# EasyEDA Pro project 学期项目.epro, schematic Schematic1

## Sheets
1 P2: Assembly Variant: Basic; Board Name: Board1; Create Date: 2026-03-26; Page Name: P2; Project Name: 学期项目_2026-03-26_14-34-54; Schematic Name: Schematic1; Update Date: 2026-03-26; BladeWidth: 10; Company: 嘉立创EDA; Page Size: A4; RegionStart: 1; ShowBorder: 1; TitleBlock: 1; TitleBlockPosition: 3; Version: V1.0; XRegionCount: 6; YRegionCount: 4
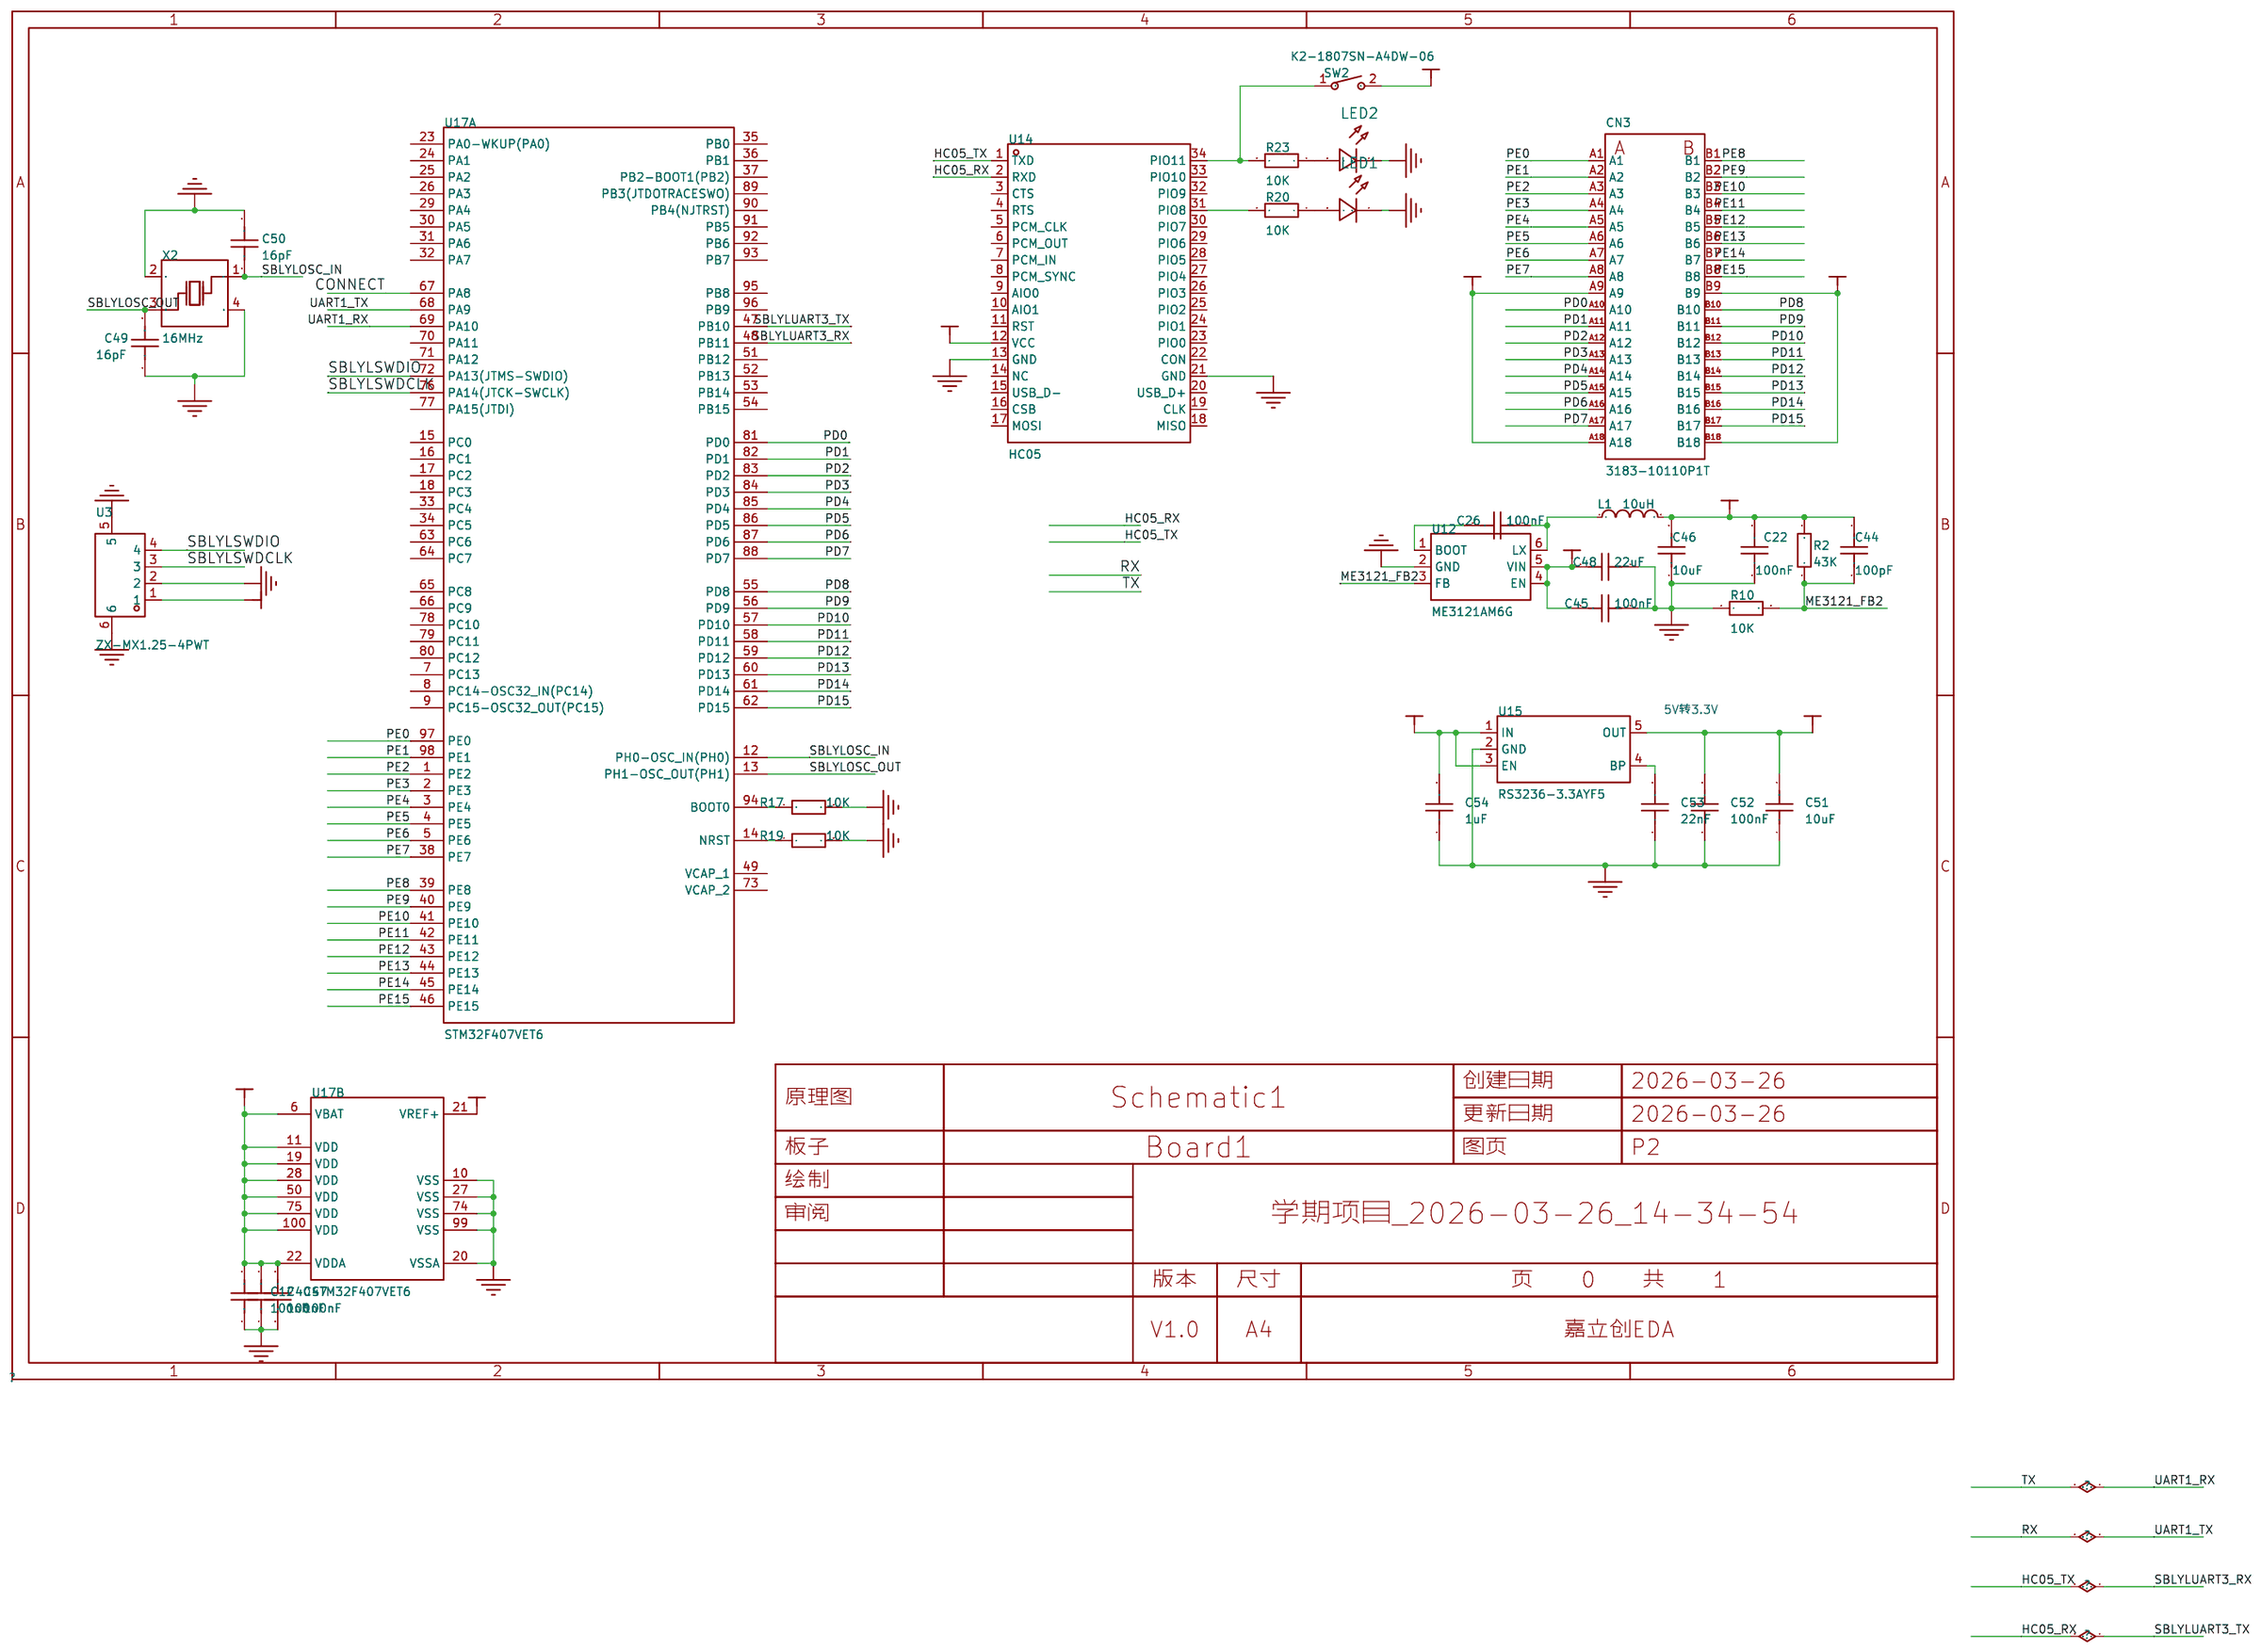
[diagram p3: P2]
2 P1: Page Name: P1
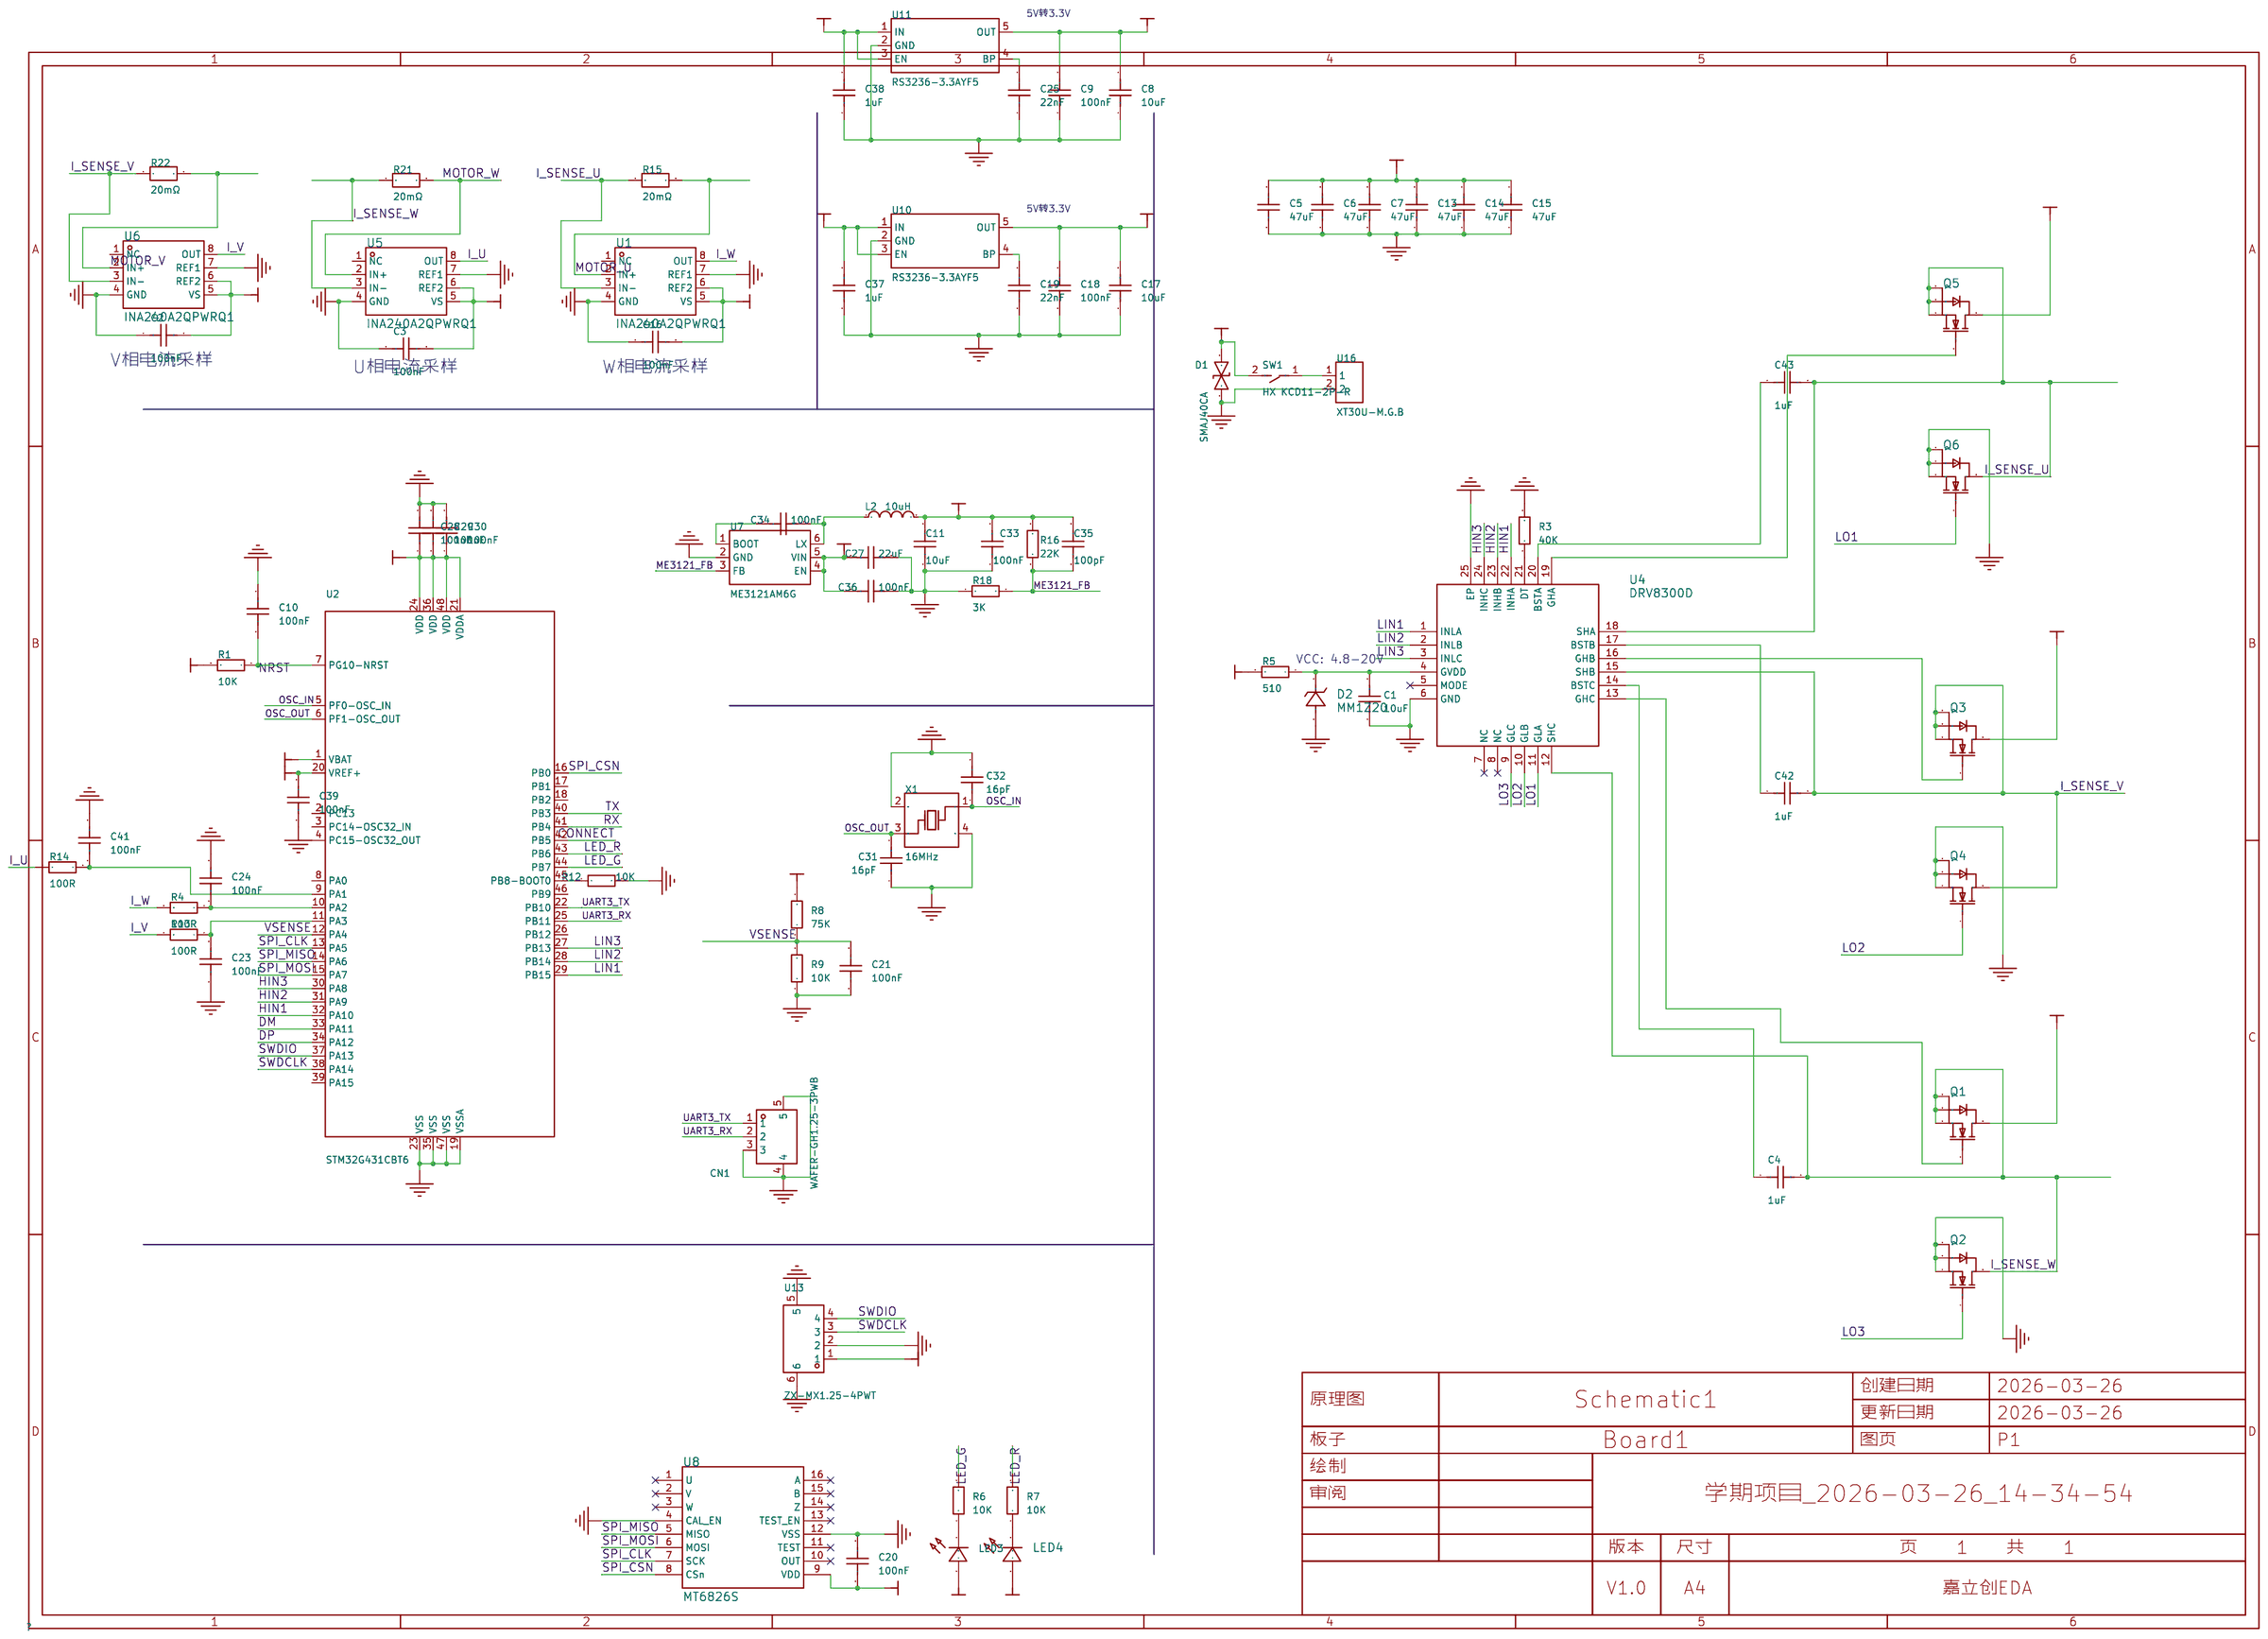
[diagram p4: P1]

## Parts
sheet P1
C1  10uF  [C0603]
C2  100nF  [C0603]
C3  100nF  [C0603]
C4  1uF  [C0603]
C5  47uF  [C1206]
C6  47uF  [C1206]
C7  47uF  [C1206]
C8  100nF  [C0603]
C9  100nF  [C0603]
C10  100nF  [C0603]
C11  10uF  [C0603]
C13  47uF  [C1206]
C14  47uF  [C1206]
C15  47uF  [C1206]
C16  100nF  [C0603]
C17  100nF  [C0603]
C18  100nF  [C0603]
C19  100nF  [C0603]
C20  100nF  [C0603]
C21  100nF  [C0603]
C23  100nF  [C0603]
C24  100nF  [C0603]
C25  100nF  [C0603]
C27  22uF  [C0603]
C28  100nF  [C0603]
C29  100nF  [C0603]
C30  100nF  [C0603]
C31  16pF  [C0603]
C32  16pF  [C0603]
C33  100nF  [C0603]
C34  100nF  [C0603]
C35  100pF  [C0603]
C36  100nF  [C0603]
C37  1uF  [C0603]
C38  1uF  [C0603]
C39  100nF  [C0603]
C41  100nF  [C0603]
C42  1uF  [C0603]
C43  1uF  [C0603]
CN1  WAFER-GH1.25-3PWB  [CONN-TH_3P-P1.25_GH1.25]
D1  SMAJ40CA  [SMA_L4.3-W2.6-LS5.0-BI]
D2  MM1Z20  [SOD-123_L2.7-W1.6-LS3.7-RD]
L2  10uH  [IND-SMD_L4.4-W4.2]
LED3  -  [LED_0603]
LED4  -  [LED_0603]
Q1  AON7544  [DFN-8_L3.3-W3.3-P0.65-BL-2]
Q2  AON7544  [DFN-8_L3.3-W3.3-P0.65-BL-2]
Q3  AON7544  [DFN-8_L3.3-W3.3-P0.65-BL-2]
Q4  AON7544  [DFN-8_L3.3-W3.3-P0.65-BL-2]
Q5  AON7544  [DFN-8_L3.3-W3.3-P0.65-BL-2]
Q6  AON7544  [DFN-8_L3.3-W3.3-P0.65-BL-2]
R1  10K  [R0603]
R3  40K  [R0603]
R4  100R  [R0603]
R5  510  [R0603]
R6  10K  [R0603]
R7  10K  [R0603]
R8  75K  [R0603]
R9  10K  [R0603]
R12  10K  [R0603]
R13  100R  [R0603]
R14  100R  [R0603]
R15  20mΩ  [R1206]
R16  22K  [R0603]
R18  3K  [R0603]
R21  20mΩ  [R1206]
R22  20mΩ  [R1206]
SW1  HX KCD11-2P-R  [SW-TH_2P-L15.0-W10.5-P5.00_KCD11-2P-R]
U1  INA240A2QPWRQ1  [TSSOP-8_L4.4-W3.0-P0.65-LS6.4-BL]
U2  STM32G431CBT6  [LQFP-48_L7.0-W7.0-P0.50-LS9.0-BL]
U4  DRV8300D  [QFN24_L4.0_W4.0_P0.5]
U5  INA240A2QPWRQ1  [TSSOP-8_L4.4-W3.0-P0.65-LS6.4-BL]
U6  INA240A2QPWRQ1  [TSSOP-8_L4.4-W3.0-P0.65-LS6.4-BL]
U7  ME3121AM6G  [SOT-23-6_L2.9-W1.6-P0.95-LS2.8-BR]
U8  MT6826S  [TSSOP16_L5.0_W4.4_P0.65]
U10  RS3236-3.3AYF5  [SOT-23-5_L3.0-W1.7-P0.95-LS2.8-BR]
U11  RS3236-3.3AYF5  [SOT-23-5_L3.0-W1.7-P0.95-LS2.8-BR]
U13  ZX-MX1.25-4PWT  [CONN-SMD_4P-P1.25-MX1.25-4P-WT]
U16  XT30U-M.G.B  [CONN-TH_XT30U-M]
X1  16MHz  [OSC-SMD_4P-L3.2-W2.5-BL]
sheet P2
C12  100nF  [C0603]
C22  100nF  [C0603]
C26  100nF  [C0603]
C40  100nF  [C0603]
C44  100pF  [C0603]
C45  100nF  [C0603]
C46  10uF  [C0603]
C47  100nF  [C0603]
C48  22uF  [C0603]
C49  16pF  [C0603]
C50  16pF  [C0603]
C51  100nF  [C0603]
C52  100nF  [C0603]
C53  100nF  [C0603]
C54  1uF  [C0603]
CN3  3183-10110P1T  [CONN-TH_36P-P1.00-V_3183-XXXXXPXT]
L1  10uH  [IND-SMD_L4.4-W4.2]
LED1  -  [LED_0603]
LED2  -  [LED_0603]
R2  43K  [R0603]
R10  10K  [R0603]
R17  10K  [R0603]
R19  10K  [R0603]
R20  10K  [R0603]
R23  10K  [R0603]
SW2  K2-1807SN-A4DW-06  [SW-SMD_L4.0-W2.9-LS4.8-1]
U3  ZX-MX1.25-4PWT  [CONN-SMD_4P-P1.25-MX1.25-4P-WT]
U12  ME3121AM6G  [SOT-23-6_L2.9-W1.6-P0.95-LS2.8-BR]
U14  HC05  [BULETM-SMD_HC-05]
U15  RS3236-3.3AYF5  [SOT-23-5_L3.0-W1.7-P0.95-LS2.8-BR]
U17  STM32F407VET6  [LQFP-100_L14.0-W14.0-P0.50-LS16.0-BL]  (sections 1,2)
X2  16MHz  [OSC-SMD_4P-L3.2-W2.5-BL]

## Library data of the parts
C1-C4 C10 C12 C16 C20-C24 C26 C28-C36 C39-C45 C47 C49 C50 = CAP_0603: Supplier Footprint: 0603
C5-C7 C13-C15 = CAP_1206: Supplier Footprint: 1206
C8 C9 C17-C19 C25 C37 C38 C51-C54 = CAP_0603: Supplier Footprint: 0603; Check: false
C11 C46 = CGA0603X5R106K100JT: 容值:10uF;精度:±10%;额定电压:10V;温度系数:X5R;; LCSC Part Name: 10uF ±10% 10V; Supplier Part: C6119842; Manufacturer: HRE(芯声); Supplier Footprint: 0603; JLCPCB Part Class: Extended Part; Supplier: LCSC; Tolerance: ±10%; Voltage Rating: 10V; Temperature Coefficient: X5R
C27 C48 = CL10A226MO7JZNC: 容值:22uF;精度:±20%;额定电压:16V;温度系数:X5R;; LCSC Part Name: 22uF ±20% 16V; Supplier Part: C2762594; Manufacturer: SAMSUNG(三星); Supplier Footprint: 0603; JLCPCB Part Class: Extended Part; Datasheet: https://item.szlcsc.com/datasheet/CL10A226MO7JZNC/2889856.html; Supplier: LCSC; Tolerance: ±20%; Voltage Rating: 16V; Temperature Coefficient: X5R
CN1 = WAFER-GH1.25-3PWB: 插针结构:1x3P;间距:1.25mm;安装方式:卧贴;参考系列:GH;总PIN数:3P;排数:1;每排PIN数:3;行距:-;额定电流:1A;触头材质:黄铜;触头镀层:-;工作温度范围:-25℃~+85℃;; LCSC Part Name: 1x3P 间距:1.25mm 卧贴 系列:GH; Supplier Part: C3029378; Manufacturer: XUNPU(讯普); Supplier Footprint: SMD,P=1.25mm,卧贴; JLCPCB Part Class: 扩展库; Datasheet: https://atta.szlcsc.com/upload/public/pdf/source/20220527/CB8773BFB0913C3B8ABD62CB38BA101A.pdf; Supplier: LCSC; Pins Structure: 1x3P; Pitch: 1.25mm; Mounting Type: 卧贴; Reference Series: GH; Number of Pins: 3P; Number of Rows: 1; Number of PINs Per Row: 3; Current Rating: 1A; Contact Material: 黄铜; Operating Temperature: -25℃~+85℃; Voltage Rating: 125V; Plastic Material: LCP; Supplementary Features: 辅助焊脚; Color: 米色; Z-Height of the Board: 4.35mm; X-Length of Bottom Edge on Board (Spacing Line): 7mm; Y-Width of Bottom Edge on Board: 5mm
D1 = SMAJ40CA_C223989: 反向截止电压(Vrwm):40V;最大钳位电压:64.5V;峰值脉冲电流(Ipp):6.2A;峰值脉冲功率(Ppp):400W;击穿电压:44.4V;; LCSC Part Name: 双向TVS 40V截止 6.2A峰值脉冲; Supplier Part: C223989; Manufacturer: Littelfuse(美国力特); Supplier Footprint: SMA(DO-214AC); JLCPCB Part Class: 扩展库; Datasheet: https://atta.szlcsc.com/upload/public/pdf/source/20190402/C374025_5ACE77BC72947DF13CF0CBC7F8B57228.pdf; Supplier: LCSC; Reverse Stand-Off Voltage (Vrwm): 40V; Maximum Clamping Voltage: 64.5V; Peak Pulse Current (Ipp): 6.2A; Peak Pulse Power Dissipation (Ppp): 400W; Breakdown Voltage: 44.4V; Type: TVS
D2 = MM1Z20_C22379467: 二极管配置:独立式;稳压值(标称值):20V;稳压值(范围):18.8V~21.2V;耗散功率(Pd):500mW;; LCSC Part Name: 独立式 耐压:20V 电流:0.1uA@15V; Supplier Part: C22379467; Manufacturer: R+O(宏嘉诚); Supplier Footprint: SOD-123; JLCPCB Part Class: Extended Part; Datasheet: https://item.szlcsc.com/datasheet/MM1Z20/23902947.html; Supplier: LCSC; Diode Configuration: 独立式; Zener Voltage(Nom): 20V; Reverse Leakage Current (Ir): 100nA@15V; Zener Voltage(Range): 18.8V~21.2V; Pd - Power Dissipation: 500mW; Impedance(Zzt): 50Ω; Operating Junction Temperature Range: -55℃~+150℃
L1 L2 = FXL0420-100-M: 电感值:10uH;精度:±20%;额定电流:1.6A;饱和电流(Isat):2.2A;类型:一体成型电感;; LCSC Part Name: 10uH ±20% 2.2A; Supplier Part: C177242; Manufacturer: cjiang(长江微电); Supplier Footprint: SMD,4.2x4.4mm; JLCPCB Part Class: 扩展库; Datasheet: https://atta.szlcsc.com/upload/public/pdf/source/20240426/3189EA8206330E2108542F9E34E540E7.pdf; Supplier: LCSC; Tolerance: ±20%; Rated Current: 1.6A; Saturation Current (Isat): 2.2A; DC Resistance (DCR): 282mΩ; Type: 一体成型电感
LED3 = LED_0603-G: Supplier Footprint: 0603
LED1 LED2 LED4 = LED_0603-R: Supplier Footprint: 0603
Q1-Q6 = AON7544: 数量:1个N沟道;漏源电压(Vdss):30V;连续漏极电流(Id):-;导通电阻(RDS(on)):5mΩ@10V;耗散功率(Pd):-;阈值电压(Vgs(th)):2.2V@250uA;; LCSC Part Name: 1个N沟道 耐压:30V 电流:30A; Supplier Part: C315567; Manufacturer: AOS; Supplier Footprint: DFN-8(3x3); JLCPCB Part Class: Extended Part; Datasheet: https://item.szlcsc.com/datasheet/AON7544/297244.html; Supplier: LCSC; Number: 1个N沟道; Drain to Source Voltage: 30V; RDS(on): 5mΩ@10V; Gate Threshold Voltage (Vgs(th)): 2.2V@250uA; Gate Charge(Qg): 22.5nC@10V; Input Capacitance(Ciss): 951pF; Reverse Transfer Capacitance (Crss@Vds): 62pF; Operating Temperature: -55℃~+150℃; Output Capacitance(Coss): 373pF
R1-R10 R12-R14 R16-R20 R23 = Res_0603: Supplier Footprint: 0603
R15 R21 R22 = JER1206F1R020: 电阻类型:采样电阻；合金电阻;阻值:20mΩ;精度:±1%;功率:1W;温度系数:±50ppm/℃;; LCSC Part Name: 20mΩ 1W 1206 ±1%; Supplier Part: C46634440; Manufacturer: JIERR(捷而瑞); Supplier Footprint: 1206; JLCPCB Part Class: Extended Part; Datasheet: https://item.szlcsc.com/datasheet/JER1206F1R020/48788242.html; Supplier: LCSC; Type: 采样电阻；合金电阻; Tolerance: ±1%; Power(Watts): 1W; Temperature Coefficient: ±50ppm/℃
SW1 = HX KCD11-2P-R: 带灯:无;引脚样式:焊片;额定电流:3A;额定电压(AC):250V;电路结构:单刀单掷;工作寿命:1万次;; LCSC Part Name: 10.5*15mm 两脚两档跷板开关 红钮; Supplier Part: C6917318; Manufacturer: hanxia(韩下); Supplier Footprint: 插件; JLCPCB Part Class: Extended Part; Datasheet: https://item.szlcsc.com/datasheet/HX%2520KCD11-2P-R/7881930.html; Supplier: LCSC; With Lamp: 无; Termination Style: 焊片; Actuator Color: 红色; Current Rating: 3A; Voltage Rating (AC): 250V; Circuit: 单刀单掷; Life: 1万次
U1 U5 U6 = INA240A2QPWRQ1: 放大器数:单路;共模电压:-4V~80V;增益:50V/V;带宽:400kHz;; LCSC Part Name: 4V至80V、具有增强型PWM抑制的双向、超精密电流检测放大器; Supplier Part: C544529; Manufacturer: TI(德州仪器); Supplier Footprint: TSSOP-8; JLCPCB Part Class: Extended Part; Datasheet: https://www.ti.com/cn/lit/gpn/ina240-q1; Supplier: LCSC; Number of Channels: 单路; Vcm - Common Mode Voltage: -4V~80V; Gain: 50V/V; Bandwidth: 400kHz; Ib - Input Bias Current: 90uA; Vos - Input Offset Voltage: 5uV; Operating Temperature: -40℃~+125℃; Differential Voltage: -80V~+80V; Single Supply: 2.7V~5.5V; Quiescent Current: 1.8mA; Input Offset Voltage Drift(Vos TC): 250nV/℃; Slew Rate: 2V/us; Common Mode Rejection Ratio (CMRR): 132dB; Noise density(eN): 40pV/√Hz@1kHz
U2 = STM32G431CBT6: CPU内核:ARM-M系列;CPU最大主频:170MHz;应用领域:-;; LCSC Part Name: 带DSP和FPU的170MHz主流ARM Cortex-M4 MCU，具有128 KB Flash存储器、数学加速器和中等模拟电平集成; Supplier Part: C529355; Manufacturer: ST(意法半导体); Supplier Footprint: LQFP-48(7x7); JLCPCB Part Class: Extended Part; Datasheet: https://item.szlcsc.com/datasheet/STM32G431CBT6/549633.html; Supplier: LCSC; CPU Core: ARM-M系列; CPU Maximum Speed: 170MHz; Program Storage Size: 128KB; Program Memory Type: FLASH; Number of I/O: 38; ADC (Bit): 12bit; DAC (Bit): 12bit; Voltage - Supply: 1.71V~3.6V
U4 = DRV8300D: 具有自举二极管的最大 100V 简单三相栅极驱动器; LibraryName: 电机驱动IC
U7 U12 = ME3121AM6G: 功能类型:降压型;输出类型:可调;工作电压:4.7V~40V;输出电压:-;输出电流:-;; LCSC Part Name: 40V输入1A负载同步整流降压DC-DC转换器; Supplier Part: C2932938; Manufacturer: MICRONE(南京微盟); Supplier Footprint: SOT-23-6; JLCPCB Part Class: 扩展库; Datasheet: https://atta.szlcsc.com/upload/public/pdf/source/20220331/EB46EBF6ED46F90696A7B4CB82ED1A1E.pdf; Supplier: LCSC; Function: 降压型; Output Type: 可调; Voltage - Supply: 4.7V~40V; Frequency - Switching: 1MHz; Operating Temperature: -40℃~+85℃; Synchronous Rectifier: 是; Number of Outputs: 1; Topology: 降压式; Quiescent Current: 120uA; Switch tube (built-in/external): 内置
U8 = MT6826S: 15位高分辨率、高速磁性角度编码器IC; LibraryName: 其他
U10 U11 U15 = RS3236-3.3AYF5: 输出类型:固定;工作电压:7.5V;输出电压:3.3V;输出电流:500mA;电源纹波抑制比(PSRR):74dB@(217Hz);输出极性:正极;; Supplier Part: C2913557; Manufacturer: RUNIC(润石); Supplier Footprint: SOT-23-5; JLCPCB Part Class: 扩展库; Datasheet: https://atta.szlcsc.com/upload/public/pdf/source/20211119/36BE441864376B022A326601AD3750E6.pdf; Supplier: LCSC; Output Type: 固定; Voltage - Supply: 7.5V; Output Voltage: 3.3V; Output Current: 500mA; Power Supply Rejection Ratio (PSRR): 74dB@(217Hz); Features: 防静电保护；低ESR；热关断(TSD)；过流保护(OCP)；带使能; Operating Temperature: -40℃~+85℃@(Ta); Output Configuration: 正极; Number of Outputs: 1
U3 U13 = ZX-MX1.25-4PWT: 插针结构:1x4P;间距:1.25mm;安装方式:卧贴;参考系列:PicoBlade(MX 1.25);总PIN数:4P;排数:1;每排PIN数:4;行距:-;额定电流:1A;触头材质:黄铜;触头镀层:锡;工作温度:-25℃~+85℃;; LCSC Part Name: 1x4P 间距:1.25mm 卧贴 系列:PicoBlade(MX 1.25); Supplier Part: C7430470; Manufacturer: Megastar(兆星); Supplier Footprint: SMD,P=1.25mm,卧贴; JLCPCB Part Class: Extended Part; Datasheet: https://item.szlcsc.com/datasheet/ZX-MX1.25-4PWT/8430339.html; Supplier: LCSC; Pins Structure: 1x4P; Pitch: 1.25mm; Mounting Type: 卧贴; Reference Series: PicoBlade(MX 1.25); Number of Pins: 4P; Number of Rows: 1; Number of PINs Per Row: 4; Current Rating: 1A; Contact Material: 黄铜; Contact Plating: 锡; Operating Temperature: -25℃~+85℃; Voltage Rating: 125V; Plastic Material: LCP; Supplementary Features: 辅助焊脚; Color: 米色; Z-Height of the Board: 3.6mm; X-Length of Bottom Edge on Board (Spacing Line): 10mm; Y-Width of Bottom Edge on Board: 5.25mm
U16 = XT30U-M.G.B: LCSC Part Name: XT30U 2芯锂电插头黑色镀金公头15A; Supplier Part: C19268020; Manufacturer: AMASS(艾迈斯); JLCPCB Part Class: Extended Part; Datasheet: https://item.szlcsc.com/datasheet/XT30U-M.G.B/20526031.html; Supplier: LCSC
X1 X2 = X322516MLB4SI: 晶振类型:贴片晶振;频率:16MHz;常温频差:±10ppm;负载电容:9pF;频率稳定度:±20ppm;; LCSC Part Name: YSX321SL 16MHZ 4P 3225 9PF ±10PPM -40~85℃ (±20PPM); Supplier Part: C13738; Manufacturer: YXC(扬兴晶振); Supplier Footprint: SMD3225-4P; JLCPCB Part Class: Basic Part; Datasheet: https://item.szlcsc.com/datasheet/X322516MLB4SI/14393.html; Supplier: LCSC; Type: 贴片晶振; Normal temperature Frequency Tolerance: ±10ppm; Load Capacitance: 9pF; Frequency Stability: ±20ppm; Operating Temperature: -40℃~+85℃
CN3 = 3183-10110P1T: PCIE3.0 DIP连接器 带双定位柱 卡边缘插槽; LCSC Part Name: 黑色 PCIE3.0 DIP连接器 带双定位柱 卡边缘插槽; Supplier Part: C404109; Manufacturer: UMaxconn(友贸); Supplier Footprint: 插件,P=1mm; JLCPCB Part Class: Extended Part; Datasheet: https://item.szlcsc.com/datasheet/3183-10110P1T/391111.html; Supplier: LCSC; Number of Pins: 36P; Number of Data Pins: 142P; Mounting Type: 直插; Versions: PCI-E 3.0; Height Above Board: 11.25mm; Supplementary Features: 带柱; Operating Temperature: -40℃~+85℃
SW2 = K2-1807SN-A4DW-06: 作用力:250gf;安装方式:立贴;开关长度:4mm;开关宽度:2.9mm;开关高度:2mm;触点电流:50mA;额定电压(DC):12V;绝缘电阻:100MΩ;机械寿命:10万次;; LCSC Part Name: 3×4×2 250G 2P 无柱 双弹片 防水膜; Supplier Part: C707339; Manufacturer: 韩国韩荣; Supplier Footprint: SMD; JLCPCB Part Class: 扩展库; Datasheet: https://atta.szlcsc.com/upload/public/pdf/source/20210810/47B2303F2A54EA82C8741CE08BEBC5F9.pdf; Supplier: LCSC; Operating Force: 250gf; Mounting Style: 立贴; Switch Length: 4mm; Switch Width: 2.9mm; Switch Height: 2mm; Contact Current: 50mA; Voltage Rating (DC): 12V; Insulation Resistance: 100MΩ; Mechanical Life: 10万次; Operating Temperature: -25℃~+85℃
U14 = HC05: Supplier Part: C9900088934; Supplier Footprint: HC-05; JLCPCB Part Class: Extended Part; Supplier: LCSC
U17 = STM32F407VET6: CPU内核:ARM-M4;CPU最大主频:168MHz;应用领域:-;; LCSC Part Name: 带DSP和FPU的高性能基础系列ARM Cortex-M4 MCU，具有512 KB Flash、168 MHz CPU、ART加速器、以太网和FSMC; Supplier Part: C28730; Manufacturer: ST(意法半导体); Supplier Footprint: LQFP-100(14x14); JLCPCB Part Class: Extended Part; Datasheet: https://item.szlcsc.com/datasheet/STM32F407VET6/29482.html; Supplier: LCSC; CPU Core: ARM-M4; CPU Maximum Speed: 168MHz; Program Storage Size: 512KB; Program Memory Type: FLASH; Number of I/O: 82; ADC (Bit): 12bit; DAC (Bit): 12bit; Voltage - Supply: 1.8V~3.6V

## Nets
+3.3V: U3.1
+5V: C11.2 C33.2 C35.2 C37.2 C38.2 C54.2 L2.2 R16.2 U10.1(IN) U10.3(EN) U11.1(IN) U11.3(EN) U15.1(IN) U15.3(EN)
AVCC: C2.2 C3.2 C8.2 C9.2 C16.2 C39.2 U1.5(VS) U1.6(REF2) U2.20(VREF+) U5.5(VS) U5.6(REF2) U6.5(VS) U6.6(REF2) U11.5(OUT)
GND: C1.1 C2.1 C3.1 C5.1 C6.1 C7.1 C8.1 C9.1 C10.1 C11.1 C12.1 C13.1 C14.1 C15.1 C16.1 C17.1 C18.1 C19.1 C20.2 C21.1 C22.1 C23.1 C24.2 C25.1 C27.1 C28.2 C29.2 C30.2 C31.1 C32.2 C33.1 C36.1 C37.1 C38.1 C39.1 C40.1 C41.2 C45.1 C46.1 C47.1 C48.1 C49.1 C50.2 C51.1 C52.1 C53.1 C54.1 CN1.3 CN1.4 CN1.5 D1.1 D2.2(A) LED1.1(C) LED2.1(C) Q2.1(S) Q2.2(S) Q2.3(S) Q4.1(S) Q4.2(S) Q4.3(S) Q6.1(S) Q6.2(S) Q6.3(S) R3.2 R9.1 R10.1 R12.2 R17.2 R18.1 R19.2 U1.4(GND) U1.7(REF1) U2.19(VSSA) U2.23(VSS) U2.35(VSS) U2.47(VSS) U3.2 U3.5 U3.6 U4.6(GND) U4.25(EP) U5.4(GND) U5.7(REF1) U6.4(GND) U6.7(REF1) U7.2(GND) U8.4(CAL_EN) U8.12(VSS) U10.2(GND) U11.2(GND) U12.2(GND) U13.2 U13.5 U13.6 U14.13(GND) U14.21(GND) U15.2(GND) U16.2 U17.10(VSS) U17.20(VSSA) U17.27(VSS) U17.74(VSS) U17.99(VSS) X1.2(GND) X1.4(GND) X2.2(GND) X2.4(GND)
PVCC: C5.2 C6.2 C7.2 C13.2 C14.2 C15.2 C27.2 C36.2 C45.2 C48.2 D1.2 Q1.5(D) Q3.5(D) Q5.5(D) R5.2 R8.2 SW1.2 U7.4(EN) U7.5(VIN) U12.4(EN) U12.5(VIN)
VCC: C17.2 C18.2 C20.1 C28.1 C29.1 C30.1 LED3.2(A) LED4.2(A) R1.2 U2.1(VBAT) U2.21(VDDA) U2.24(VDD) U2.36(VDD) U2.48(VDD) U8.9(VDD) U10.5(OUT) U13.1
CONNECT: U2.42(PB5) U17.67(PA8)
DM: U2.33(PA11)
DP: U2.34(PA12)
HC05_RX: U14.2(RXD) U17.47(PB10)
HC05_TX: U14.1(TXD) U17.48(PB11)
HIN1: U2.32(PA10) U4.22(INHA)
HIN2: U2.31(PA9) U4.23(INHB)
HIN3: U2.30(PA8) U4.24(INHC)
I_SENSE_U: C43.2 Q5.1(S) Q5.2(S) Q5.3(S) Q6.5(D) R15.1 U1.3(IN-) U4.18(SHA)
I_SENSE_V: C42.2 Q3.1(S) Q3.2(S) Q3.3(S) Q4.5(D) R22.1 U4.15(SHB) U6.3(IN-)
I_SENSE_W: C4.2 Q1.1(S) Q1.2(S) Q1.3(S) Q2.5(D) R21.1 U4.12(SHC) U5.3(IN-)
I_U: R14.2 U5.8(OUT)
I_V: R13.2 U6.8(OUT)
I_W: R4.2 U1.8(OUT)
LED_G: R6.2 U2.44(PB7)
LED_R: R7.2 U2.43(PB6)
LIGHTVCC: C22.2 C44.2 C46.2 CN3.A9 CN3.A18 CN3.B9 CN3.B18 L1.2 R2.2
LIN1: U2.29(PB15) U4.1(INLA)
LIN2: U2.28(PB14) U4.2(INLB)
LIN3: U2.27(PB13) U4.3(INLC)
LO1: Q6.4(G) U4.11(GLA)
LO2: Q4.4(G) U4.10(GLB)
LO3: Q2.4(G) U4.9(GLC)
ME3121_FB: C35.1 R16.1 R18.2 U7.3(FB)
ME3121_FB2: C44.1 R2.1 R10.2 U12.3(FB)
MOTOR_U: R15.2 U1.2(IN+)
MOTOR_V: R22.2 U6.2(IN+)
MOTOR_W: R21.2 U5.2(IN+)
NRST: C10.2 R1.1 U2.7(PG10-NRST)
OSC_IN: C32.1 U2.5(PF0-OSC_IN) X1.1(OSC1)
OSC_OUT: C31.2 U2.6(PF1-OSC_OUT) X1.3(OSC2)
PD0: CN3.A10 U17.81(PD0)
PD1: CN3.A11 U17.82(PD1)
PD2: CN3.A12 U17.83(PD2)
PD3: CN3.A13 U17.84(PD3)
PD4: CN3.A14 U17.85(PD4)
PD5: CN3.A15 U17.86(PD5)
PD6: CN3.A16 U17.87(PD6)
PD7: CN3.A17 U17.88(PD7)
PD8: CN3.B10 U17.55(PD8)
PD9: CN3.B11 U17.56(PD9)
PD10: CN3.B12 U17.57(PD10)
PD11: CN3.B13 U17.58(PD11)
PD12: CN3.B14 U17.59(PD12)
PD13: CN3.B15 U17.60(PD13)
PD14: CN3.B16 U17.61(PD14)
PD15: CN3.B17 U17.62(PD15)
PE0: CN3.A1 U17.97(PE0)
PE1: CN3.A2 U17.98(PE1)
PE2: CN3.A3 U17.1(PE2)
PE3: CN3.A4 U17.2(PE3)
PE4: CN3.A5 U17.3(PE4)
PE5: CN3.A6 U17.4(PE5)
PE6: CN3.A7 U17.5(PE6)
PE7: CN3.A8 U17.38(PE7)
PE8: CN3.B1 U17.39(PE8)
PE9: CN3.B2 U17.40(PE9)
PE10: CN3.B3 U17.41(PE10)
PE11: CN3.B4 U17.42(PE11)
PE12: CN3.B5 U17.43(PE12)
PE13: CN3.B6 U17.44(PE13)
PE14: CN3.B7 U17.45(PE14)
PE15: CN3.B8 U17.46(PE15)
RX: U2.41(PB4) U17.68(PA9)
SBLYLOSC_IN: C50.1 U17.12(PH0-OSC_IN(PH0)) X2.1(OSC1)
SBLYLOSC_OUT: C49.2 U17.13(PH1-OSC_OUT(PH1)) X2.3(OSC2)
SBLYLSWDCLK: U3.3 U17.76(PA14(JTCK-SWCLK))
SBLYLSWDIO: U3.4 U17.72(PA13(JTMS-SWDIO))
SBLYLVCC: C12.2 C40.2 C47.2 C51.2 C52.2 SW2.2 U14.12(VCC) U15.5(OUT) U17.6(VBAT) U17.11(VDD) U17.19(VDD) U17.21(VREF+) U17.22(VDDA) U17.28(VDD) U17.50(VDD) U17.75(VDD) U17.100(VDD)
SPI_CLK: U2.13(PA5) U8.7(SCK)
SPI_CSN: U2.16(PB0) U8.8(CSn)
SPI_MISO: U2.14(PA6) U8.5(MISO)
SPI_MOSI: U2.15(PA7) U8.6(MOSI)
SWDCLK: U2.38(PA14) U13.3
SWDIO: U2.37(PA13) U13.4
TX: U2.40(PB3) U17.69(PA10)
UART3_RX: CN1.2 U2.25(PB11)
UART3_TX: CN1.1 U2.22(PB10)
VSENSE: C21.2 R8.1 R9.2 U2.12(PA4)
$1N8: Q3.4(G) U4.16(GHB)
$1N18: C1.2 D2.1(K) R5.1 U4.4(GVDD)
$1N19: C4.1 U4.14(BSTC)
$1N20: C42.1 U4.17(BSTB)
$1N24: C43.1 U4.20(BSTA)
$1N203: C24.1 R4.1 U2.10(PA2)
$1N245: C34.2 U7.1(BOOT)
$1N246: C34.1 L2.1 U7.6(LX)
$1N260: C19.2 U10.4(BP)
$1N283: C25.2 U11.4(BP)
$1N298: C23.2 R13.1 U2.11(PA3)
$1N301: C41.1 R14.1 U2.9(PA1)
$1N316: LED3.1(C) R6.1
$1N318: LED4.1(C) R7.1
$1N336: SW1.1 U16.1
$1N354: R12.1 U2.45(PB8-BOOT0)
$1N357: Q1.4(G) U4.13(GHC)
$1N358: R3.1 U4.21(DT)
$1N363: Q5.4(G) U4.19(GHA)
$2N76: C26.2 U12.1(BOOT)
$2N77: C26.1 L1.1 U12.6(LX)
$2N86: R17.1 U17.94(BOOT0)
$2N89: R19.1 U17.14(NRST)
$2N108: C53.2 U15.4(BP)
$2N113: R20.2 U14.31(PIO8)
$2N118: LED1.2(A) R20.1
$2N119: LED2.2(A) R23.1
$2N121: R23.2 SW2.1 U14.34(PIO11)

Not connected (* = marked no-connect by the designer): U1 1(NC); U2 2(PC13) 3(PC14-OSC32_IN) 4(PC15-OSC32_OUT) 8(PA0) 17(PB1) 18(PB2) 26(PB12) 39(PA15) 46(PB9); U4 5(MODE)* 7(NC)* 8(NC)*; U5 1(NC); U6 1(NC); U8 1(U)* 2(V)* 3(W)* 10(OUT)* 11(TEST)* 13(TEST_EN)* 14(Z)* 15(B)* 16(A)*; U14 3(CTS) 4(RTS) 5(PCM_CLK) 6(PCM_OUT) 7(PCM_IN) 8(PCM_SYNC) 9(AIO0) 10(AIO1) 11(RST) 14(NC) 15(USB_D-) 16(CSB) 17(MOSI) 18(MISO) 19(CLK) 20(USB_D+) 22(CON) 23(PIO0) 24(PIO1) 25(PIO2) 26(PIO3) 27(PIO4) 28(PIO5) 29(PIO6) 30(PIO7) 32(PIO9) 33(PIO10); U17 7(PC13) 8(PC14-OSC32_IN(PC14)) 9(PC15-OSC32_OUT(PC15)) 15(PC0) 16(PC1) 17(PC2) 18(PC3) 23(PA0-WKUP(PA0)) 24(PA1) 25(PA2) 26(PA3) 29(PA4) 30(PA5) 31(PA6) 32(PA7) 33(PC4) 34(PC5) 35(PB0) 36(PB1) 37(PB2-BOOT1(PB2)) 49(VCAP_1) 51(PB12) 52(PB13) 53(PB14) 54(PB15) 63(PC6) 64(PC7) 65(PC8) 66(PC9) 70(PA11) 71(PA12) 73(VCAP_2) 77(PA15(JTDI)) 78(PC10) 79(PC11) 80(PC12) 89(PB3(JTDOTRACESWO)) 90(PB4(NJTRST)) 91(PB5) 92(PB6) 93(PB7) 95(PB8) 96(PB9)

## Notes on the sheets
sheet 1
- 5V转3.3V
sheet 2
- 5V转3.3V
- 5V转3.3V
- V相电流采样
- U相电流采样
- W相电流采样
- VCC: 4.8-20V
